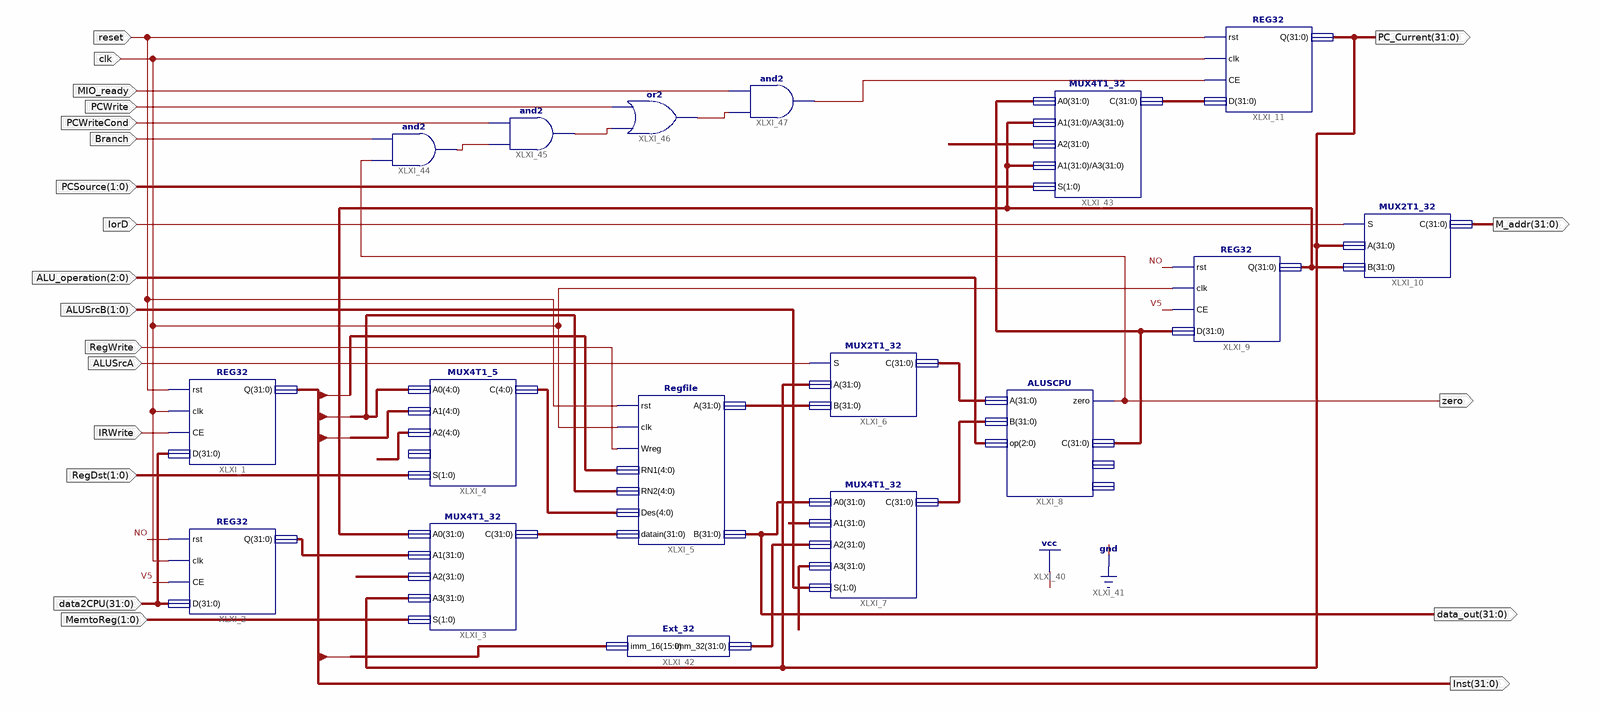
[diagram p0: schematic sheet 1]
// Xilinx ISE schematic M_datapath.sch (kintex7) as structural Verilog: 17 symbols, 21 ports
module M_datapath (
  input  reset,
  input  clk,
  input  IRWrite,
  input  [31:0] data2CPU,
  input  [1:0] RegDst,
  input  [1:0] MemtoReg,
  input  RegWrite,
  input  ALUSrcA,
  input  [1:0] ALUSrcB,
  input  [2:0] ALU_operation,
  input  IorD,
  input  [1:0] PCSource,
  input  Branch,
  input  PCWriteCond,
  input  PCWrite,
  input  MIO_ready,
  output [31:0] Inst,
  output [31:0] data_out,
  output zero,
  output [31:0] PC_Current,
  output [31:0] M_addr
);

  wire XLXN_64, XLXN_65, XLXN_66, XLXN_76;
  wire [4:0] XLXN_37;
  wire [31:0] A, ALU, B, Lui, offset, XLXN_32, XLXN_38, XLXN_39, XLXN_43, XLXN_59, XLXN_77;

  MUX4T1_32 XLXI_3 (.A0(XLXN_59), .A1(XLXN_32), .A2(Lui), .A3(PC_Current), .S(MemtoReg), .C(XLXN_38));
  MUX4T1_5 XLXI_4 (.A0(Inst[20:16]), .A1(Inst[15:11]), .A2({5{1'b1}}), .S(RegDst), .C(XLXN_37));  // open: A3
  REG32 XLXI_1 (.rst(reset), .clk(clk), .CE(IRWrite), .D(data2CPU), .Q(Inst));
  REG32 XLXI_2 (.rst(1'b0), .clk(clk), .CE(1'b1), .D(data2CPU), .Q(XLXN_32));
  Regfile XLXI_5 (
    .rst(reset), .clk(clk), .Wreg(RegWrite), .RN1(Inst[25:21]), .RN2(Inst[20:16]), .Des(XLXN_37),
    .datain(XLXN_38), .A(XLXN_39), .B(data_out));
  ALUSCPU XLXI_8 (.A(A), .B(B), .op(ALU_operation), .zero(zero), .C(ALU));  // open: S, result1
  REG32 XLXI_9 (.rst(1'b0), .clk(clk), .CE(1'b1), .D(ALU), .Q(XLXN_59));
  MUX2T1_32 XLXI_10 (.S(IorD), .A(PC_Current), .B(XLXN_59), .C(M_addr));
  REG32 XLXI_11 (.rst(reset), .clk(clk), .CE(XLXN_76), .D(XLXN_77), .Q(PC_Current));
  MUX2T1_32 XLXI_6 (.S(ALUSrcA), .A(PC_Current), .B(XLXN_39), .C(A));
  MUX4T1_32 XLXI_7 (
    .A0(data_out), .A1(32'b00000000000000000000000000000100), .A2(XLXN_43), .A3(offset), .S(ALUSrcB), .C(B));
  Ext_32 XLXI_42 (.imm_16(Inst[15:0]), .imm_32(XLXN_43));
  MUX4T1_32 XLXI_43 (
    .A0(ALU), .A1(XLXN_59), .A2({PC_Current[31:28], Inst[25:0], 2'b00}), .A3(XLXN_59), .S(PCSource),
    .C(XLXN_77));
  and XLXI_44 (XLXN_64, zero, Branch);
  and XLXI_45 (XLXN_65, XLXN_64, PCWriteCond);
  or XLXI_46 (XLXN_66, XLXN_65, PCWrite);
  and XLXI_47 (XLXN_76, XLXN_66, MIO_ready);
endmodule
